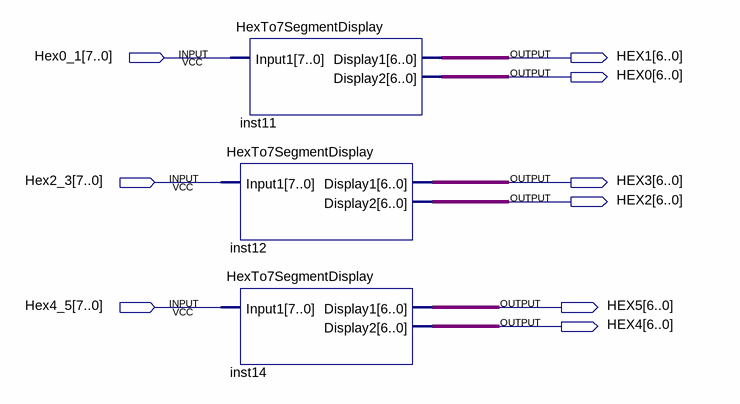
[diagram p0: schematic sheet]
// Quartus schematic HexDisplays.bdf as structural Verilog: 3 symbols, 9 pins
module HexDisplays (
  input  [7:0] Hex0_1,
  input  [7:0] Hex2_3,
  input  [7:0] Hex4_5,
  output [6:0] HEX1,
  output [6:0] HEX0,
  output [6:0] HEX3,
  output [6:0] HEX2,
  output [6:0] HEX5,
  output [6:0] HEX4
);

  HexTo7SegmentDisplay inst11 (.Input1(Hex0_1), .Display1(HEX1), .Display2(HEX0));
  HexTo7SegmentDisplay inst12 (.Input1(Hex2_3), .Display1(HEX3), .Display2(HEX2));
  HexTo7SegmentDisplay inst14 (.Input1(Hex4_5), .Display1(HEX5), .Display2(HEX4));
endmodule
